# Altium schematic sheet voltage_filter.SchDoc
size A4; SheetNumber: 3; SheetTotal: 9
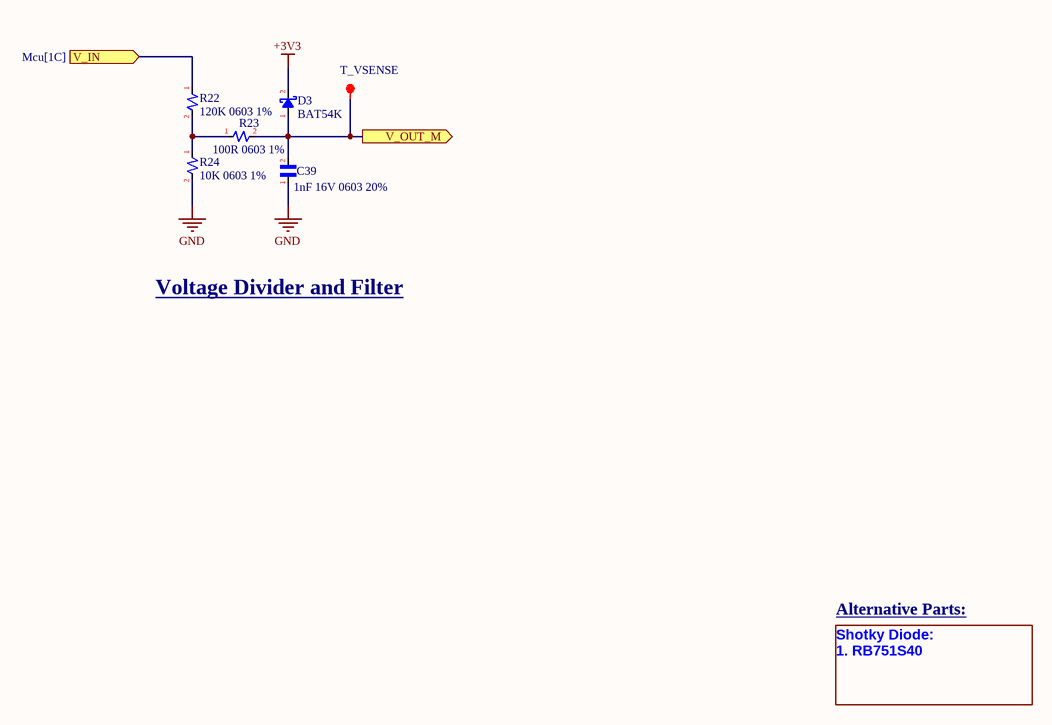
[diagram p0: voltage_filter.SchDoc]

## Parts
C39  1nF 16V 0603 20%  [C_0603]
D3  BAT54K  [SODFL1608X70N]
R22  120K 0603 1%  [R_0603]
R23  100R 0603 1%  [R_0603]
R24  10K 0603 1%  [R_0603]
TP?  T_VSENSE  [TP_1mm_SMD]  (graphical)

## Ports
V_IN (in, see Mcu[1C]), V_OUT_M (out, see Mcu[2C])

## Nets
+3V3: D3.2(K)
GND: C39.1 R24.2
V_IN: R22.1 ; port V_IN
V_OUT_M: C39.2 D3.1(A1) R23.2 TP?.1 ; port V_OUT_M
NetR22_2: R22.2 R23.1 R24.1

## Notes on the sheet
- Voltage Divider and Filter
- Alternative Parts:
- Shotky Diode:
  1. RB751S40

## Library data of the parts
C39 = Capacitor>> Non-Polar: CAP  0603 20%
D3 = Diode>>SCHOTTKEY
R22-R24 = Resistor>> General Purpose: RES 0603 20%
TP? = Test point TP